# Altium schematic sheet debug.SchDoc
size A4; SheetNumber: 2; SheetTotal: 3
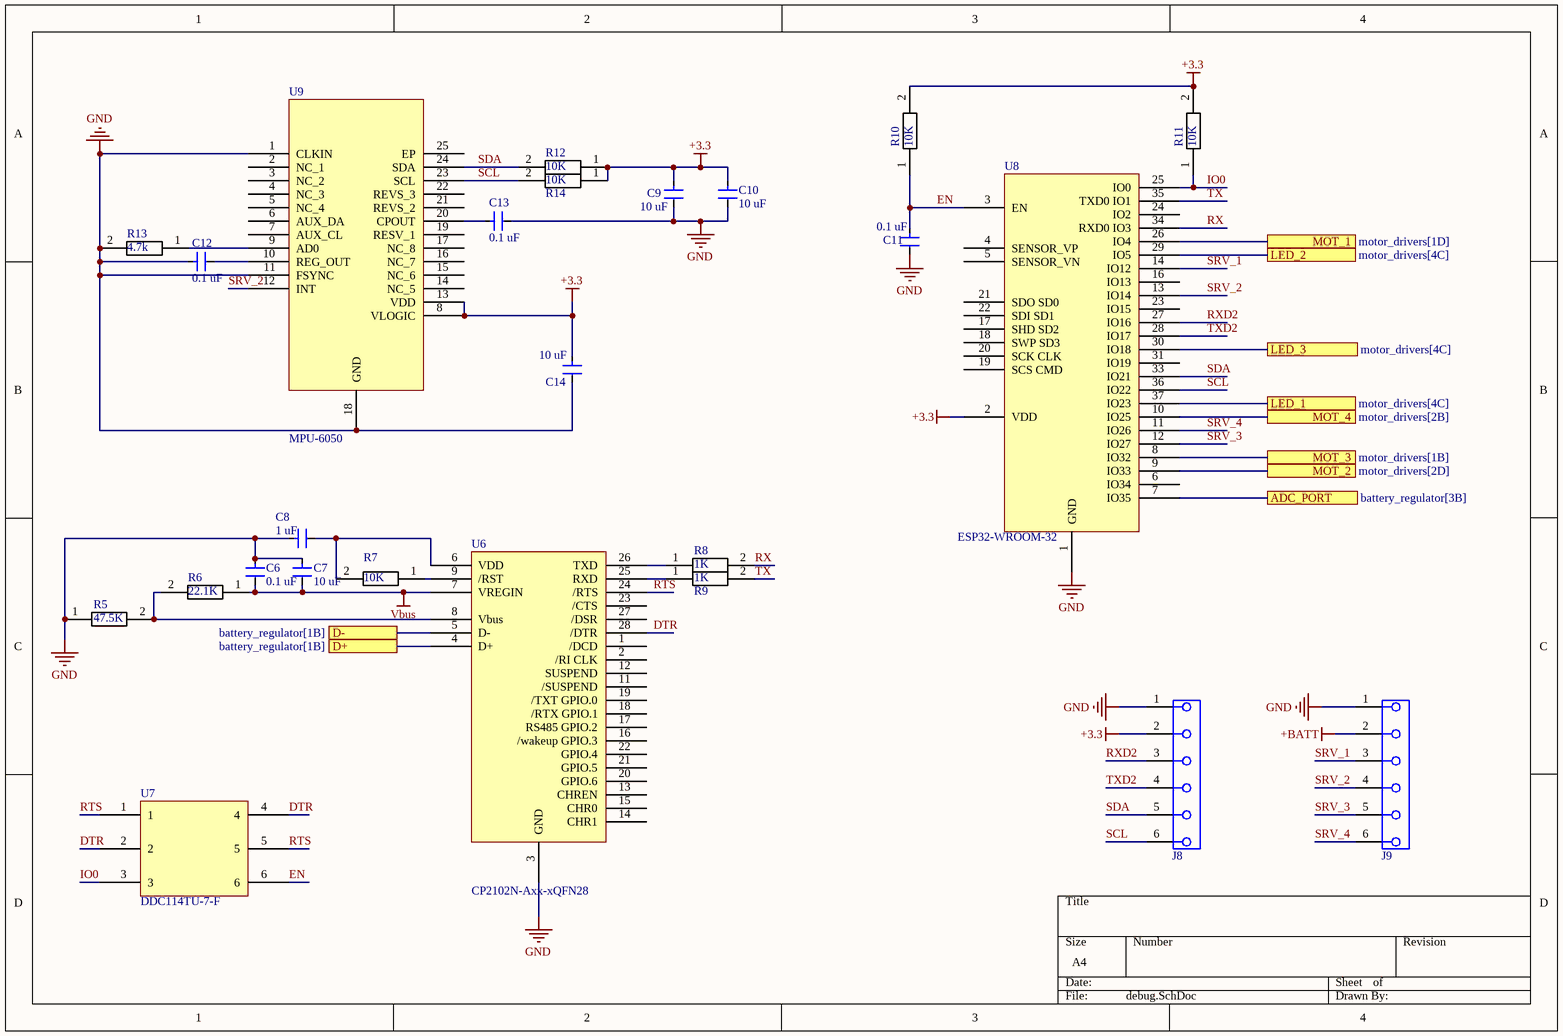
[diagram p0: debug.SchDoc]

## Parts
C6  0.1 uF  [res0805ph]
C7  10 uF  [res0805ph]
C8  1 uF  [res0805ph]
C9  10 uF  [res0805ph]
C10  10 uF  [res0805ph]
C11  0.1 uF  [res0805ph]
C12  0.1 uF  [res0805ph]
C13  0.1 uF  [res0805ph]
C14  10 uF  [res0805ph]
J8  SSW-106-02-T-S-RA  [61300611121]  (value not drawn)
J9  SSW-106-02-T-S-RA  [61300611121]  (value not drawn)
R5  47.5K  [res0805ph]
R6  22.1K  [res0805ph]
R7  10K  [res0805ph]
R8  1K  [res0805ph]
R9  1K  [res0805ph]
R10  10K  [res0805ph]
R11  10K  [res0805ph]
R12  10K  [res0805ph]
R13  4.7k  [res0805ph]
R14  10K  [res0805ph]
U6  CP2102N-Axx-xQFN28  [QFN50P500X500X80-29N]
U7  DDC114TU-7-F  [SOT65P210X110-6N]
U8  ESP32-WROOM-32  [ESP32-WROOM-32D]
U9  MPU-6050  [IS-QFN-24_V]

## Ports
ADC_PORT (see battery_regulator[3B]), D+ (see battery_regulator[1B]), D- (see battery_regulator[1B]), LED_1 (see motor_drivers[4C]), LED_2 (see motor_drivers[4C]), LED_3 (see motor_drivers[4C]), MOT_1 (see motor_drivers[1D]), MOT_2 (see motor_drivers[2D]), MOT_3 (see motor_drivers[1B]), MOT_4 (see motor_drivers[2B])

## Nets
+3.3: C9.1 C10.1 C14.1 J8.2 R10.2 R11.2 R12.1 R14.1 U8.2(VDD) U9.8(VLOGIC) U9.13(VDD)
+BATT: J9.2
GND: C6.1 C7.1 C8.1 C9.2 C10.2 C11.2 C12.1 C13.2 C14.2 J8.1 J9.1 R5.1 R13.2 U6.3(GND) U8.1(GND) U9.1(CLKIN) U9.11(FSYNC) U9.18(GND)
Vbus: C6.2 C7.2 R6.1 U6.7(VREGIN)
ADC_PORT: U8.7(IO35) ; port ADC_PORT
D+: U6.4(D+) ; port D+
D-: U6.5(D-) ; port D-
DTR: U6.28(/DTR) U7.2 U7.4
EN: C11.1 R10.1 U7.6 U8.3(EN)
IO0: R11.1 U7.3 U8.25(IO0)
LED_1: U8.37(IO23) ; port LED_1
LED_2: U8.29(IO5) ; port LED_2
LED_3: U8.30(IO18) ; port LED_3
MOT_1: U8.26(IO4) ; port MOT_1
MOT_2: U8.9(IO33) ; port MOT_2
MOT_3: U8.8(IO32) ; port MOT_3
MOT_4: U8.10(IO25) ; port MOT_4
RTS: U6.24(/RTS) U7.1 U7.5
RX: R8.2 U8.34(RXD0_IO3)
RXD2: J8.3 U8.27(IO16)
SCL: J8.6 R14.2 U8.36(IO22) U9.23(SCL)
SDA: J8.5 R12.2 U8.33(IO21) U9.24(SDA)
SRV_1: J9.3 U8.14(IO12)
SRV_2: J9.4 U8.13(IO14) U9.12(INT)
SRV_3: J9.5 U8.12(IO27)
SRV_4: J9.6 U8.11(IO26)
TX: R9.2 U8.35(TXD0_IO1)
TXD2: J8.4 U8.28(IO17)
NetC8_2: C8.2 R7.2 U6.6(VDD)
NetC12_2: C12.2 U9.10(REG_OUT)
NetC13_1: C13.1 U9.20(CPOUT)
NetR5_2: R5.2 R6.2 U6.8(Vbus)
NetR7_1: R7.1 U6.9(/RST)
NetR8_1: R8.1 U6.26(TXD)
NetR9_1: R9.1 U6.25(RXD)
NetR13_1: R13.1 U9.9(AD0)

Not connected (* = marked no-connect by the designer): U6 1(/DCD) 2(/RI_CLK) 11(/SUSPEND) 12(SUSPEND) 13(CHREN) 14(CHR1) 15(CHR0) 16(/wakeup_GPIO.3) 17(RS485_GPIO.2) 18(/RTX_GPIO.1) 19(/TXT_GPIO.0) 20(GPIO.6) 21(GPIO.5) 22(GPIO.4) 23(/CTS) 27(/DSR); U8 4(SENSOR_VP) 5(SENSOR_VN) 6(IO34) 16(IO13) 17(SHD_SD2) 18(SWP_SD3) 19(SCS_CMD) 20(SCK_CLK) 21(SDO_SD0) 22(SDI_SD1) 23(IO15) 24(IO2) 31(IO19); U9 2(NC_1) 3(NC_2) 4(NC_3) 5(NC_4) 6(AUX_DA) 7(AUX_CL) 14(NC_5) 15(NC_6) 16(NC_7) 17(NC_8) 19(RESV_1) 21(REVS_2) 22(REVS_3) 25(EP)

## Library data of the parts
C6-C14 = CER Capacitor_1: Voltage Rating (DC): 35V; Tolerance: 20%; Capacitance: 10uF; Dielectric: X6S; Width: 0.049inch; Thickness: 0.057inch; Voltage Rating: 35V; Min Operating Temperature: -55°C; Case Code (Imperial): 0805; Mount: Surface Mount; Packaging: Tape and Reel; Case/Package: 0805; Max Operating Temperature: 105°C; Length: 0.079inch; Case Code (Metric): 2012
J8 J9 = Connector 1x6_1: SQ Post Socket, Through-hole, Right Angle, -55 to 105 degC, 2.54mm Pitch, 6-Pin, Female, RoHS; Manufacturer: Samtec; DatasheetVersion: F-214; PackageReference: SSW-106-02-X-S-RA; ComponentLink1URL: http://www.samtec.com; Temperature Range: -55 to 105 degC; Orientation: Right Angle; ComponentLink2Description: Datasheet; PartNumber: SSW-106-02-T-S-RA; PackageVersion: CA, 6/1987; Pitch: 2.54 mm; Mounting Technology: Through-hole; PackageDescription: Assembly, Socket Strip .016 X .031 Tail; ComponentLink2URL: http://www.samtec.com/documents/webfiles/pdf/SSW_TH.PDF; RoHS: True; ComponentLink3URL: http://www.samtec.com/documents/webfiles/cpdf/SSW-1XX-XX-XXX-X-XX-XXX-XX-MKT.pdf; ComponentLink1Description: Manufacturer URL; ComponentLink3Description: Package Specification
R5-R14 = Weerstand: RES SMD 5.9K OHM 1% 1/4W 1206; Manufacturer: Yageo; Manufacturer Part Number: AC1206FR-075K9L; Resistance: 5.9KΩ; Power Rating: 0.25W; Voltage Rating: 200V; Automotive Grade: Grade 0; Value: 5.9KΩ; Tolerance: 0.01; Series: AC; Mouser Description: Thick Film Resistors - SMD 1/4W 5.9ohm 1% AEC-Q200; Lead Free: Yes; Octopart: https://octopart.com/ac1206fr-075k9l-yageo-30511161; Automotive: Yes; Temperature Range High: +155°C; ComponentLink2Description: Datasheet; Ipc Land Pattern Name: RESC310160X55; Temperature Range Low: -55°C; Digikey Description: RES SMD 5.9K OHM 1% 1/4W 1206; Device Class L3: Chip SMD Resistors; Device Class L2: Resistors; Category: Res; RoHS: TRUE; Height: 0.65mm; Package: AC1206; Temperature: -55°C to +155°C; ComponentLink2URL: http://www.yageo.com/NewPortal/yageodocoutput?fileName=/pdf/R-Chip/PYu-AC_51_RoHS_L_6.pdf; Device Class L1: Passive Components; Footprint Url: http://www.yageo.com/exep/pages/download/literatures/PYu-R_Mount_10.pdf; Composition: Thick Film